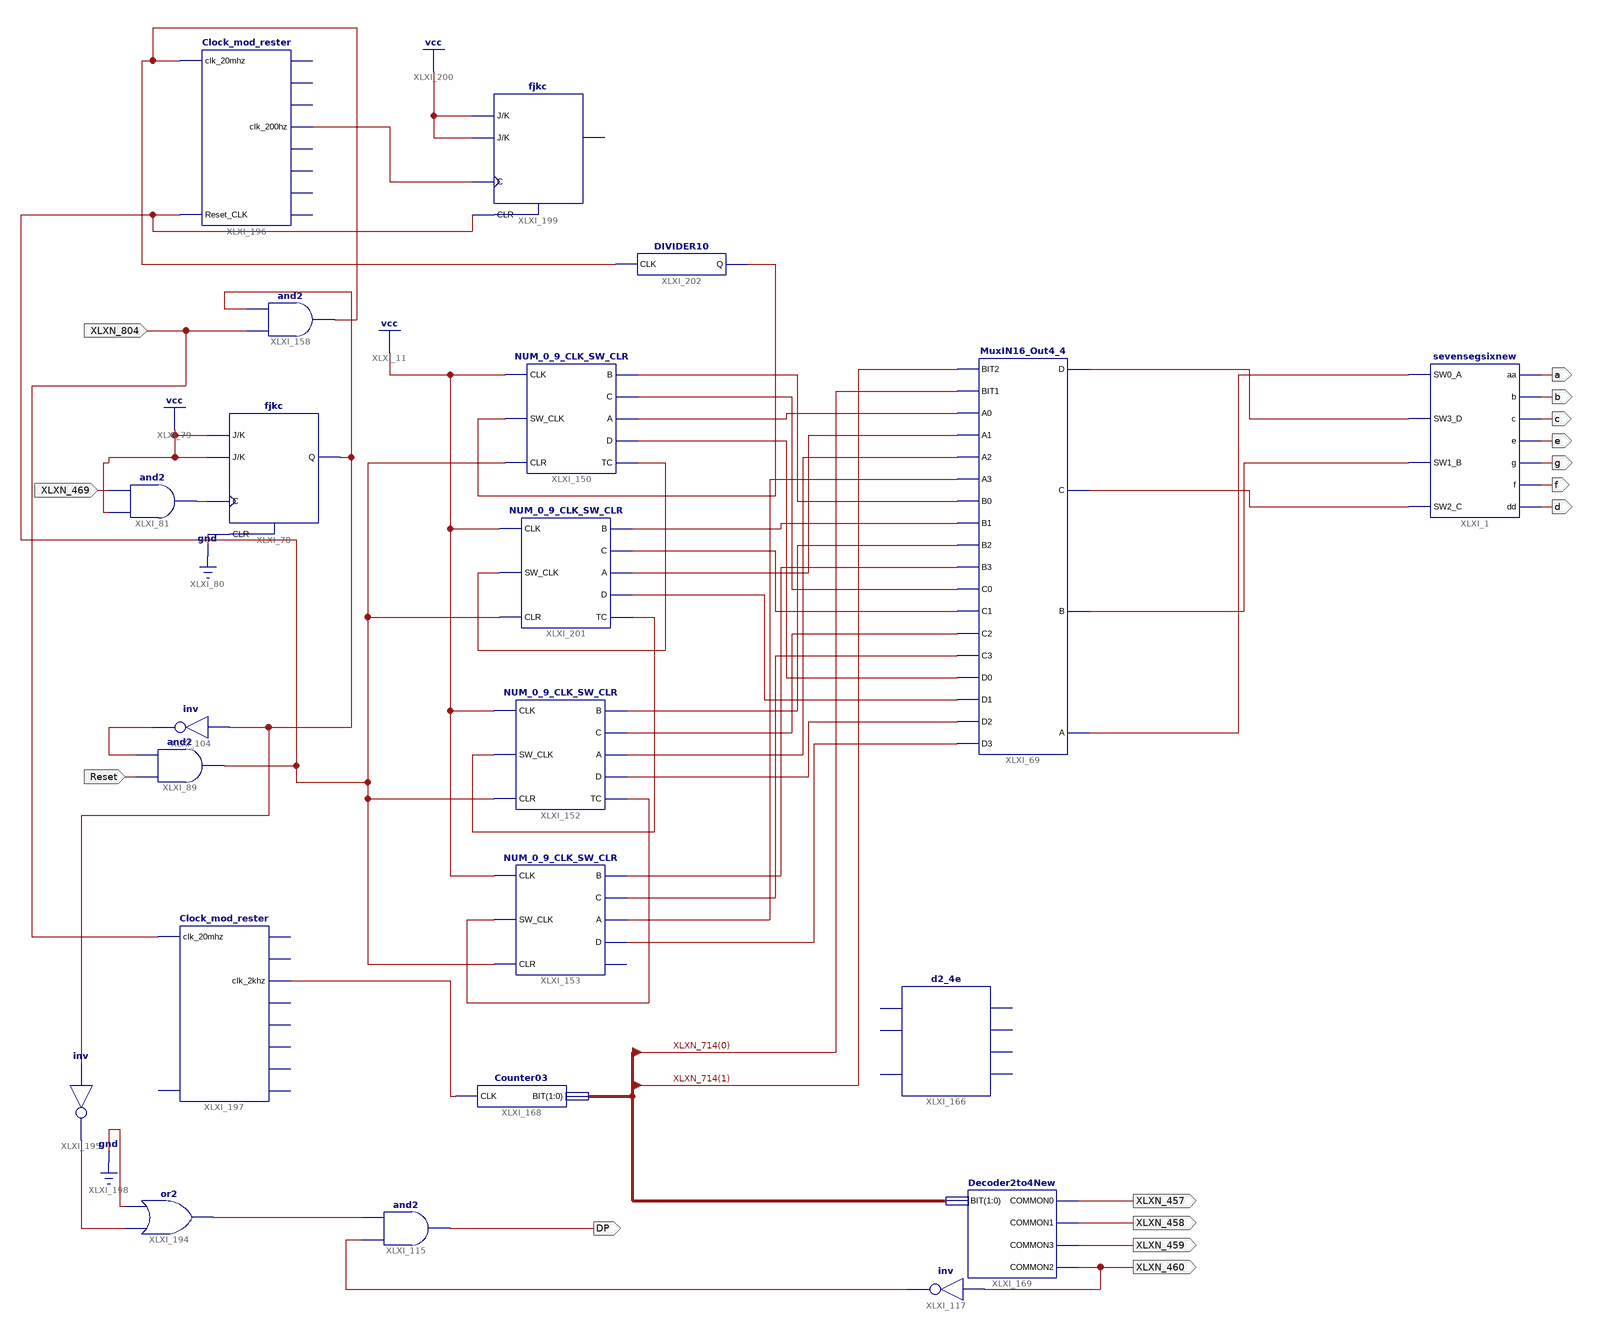
[diagram p0: schematic sheet 1]
// Xilinx ISE schematic SecondTest.sch (spartan6) as structural Verilog: 22 symbols, 15 ports
module SecondTest (
  input  XLXN_469,
  input  Reset,
  input  XLXN_804,
  output a,
  output b,
  output c,
  output e,
  output g,
  output f,
  output d,
  output XLXN_457,
  output XLXN_458,
  output XLXN_460,
  output DP,
  output XLXN_459
);

  wire XLXN_422, XLXN_423, XLXN_424, XLXN_425, XLXN_464, XLXN_468, XLXN_576, XLXN_639, XLXN_640, XLXN_641,
       XLXN_642, XLXN_653, XLXN_661, XLXN_662, XLXN_664, XLXN_665, XLXN_666, XLXN_667, XLXN_668, XLXN_669,
       XLXN_670, XLXN_671, XLXN_706, XLXN_726, XLXN_799, XLXN_802, XLXN_808, XLXN_810, XLXN_817, XLXN_818,
       XLXN_819, XLXN_820, XLXN_821, XLXN_822;
  wire [1:0] XLXN_714;

  sevensegsixnew XLXI_1 (
    .SW0_A(XLXN_425), .SW3_D(XLXN_422), .SW1_B(XLXN_424), .SW2_C(XLXN_423), .aa(a), .b(b), .c(c), .e(e),
    .g(g), .f(f), .dd(d));
  MuxIN16_Out4_4 XLXI_69 (
    .BIT2(XLXN_714[1]), .BIT1(XLXN_714[0]), .A0(XLXN_641), .A1(XLXN_819), .A2(XLXN_666), .A3(XLXN_670),
    .B0(XLXN_639), .B1(XLXN_820), .B2(XLXN_664), .B3(XLXN_668), .C0(XLXN_640), .C1(XLXN_818), .C2(XLXN_665),
    .C3(XLXN_669), .D0(XLXN_642), .D1(XLXN_817), .D2(XLXN_667), .D3(XLXN_671), .D(XLXN_422), .C(XLXN_423),
    .B(XLXN_424), .A(XLXN_425));
  fjkc XLXI_78 (.C(XLXN_468), .CLR(1'b0), .J(1'b1), .K(1'b1), .Q(XLXN_726));
  and XLXI_81 (XLXN_468, 1'b1, XLXN_469);
  and XLXI_89 (XLXN_802, Reset, XLXN_464);
  not XLXI_104 (XLXN_464, XLXN_726);
  not XLXI_117 (XLXN_576, XLXN_460);
  NUM_0_9_CLK_SW_CLR XLXI_152 (
    .CLK(1'b1), .SW_CLK(XLXN_661), .CLR(XLXN_802), .B(XLXN_664), .C(XLXN_665), .A(XLXN_666), .D(XLXN_667),
    .TC(XLXN_662));
  NUM_0_9_CLK_SW_CLR XLXI_153 (
    .CLK(1'b1), .SW_CLK(XLXN_662), .CLR(XLXN_802), .B(XLXN_668), .C(XLXN_669), .A(XLXN_670), .D(XLXN_671));  // open: TC
  d2_4e XLXI_166 ();  // open: A0, A1, E, D0, D1, D2, D3
  Counter03 XLXI_168 (.CLK(XLXN_810), .BIT(XLXN_714));
  Decoder2to4New XLXI_169 (
    .BIT(XLXN_714), .COMMON0(XLXN_457), .COMMON1(XLXN_458), .COMMON3(XLXN_459), .COMMON2(XLXN_460));
  and XLXI_115 (DP, XLXN_576, XLXN_706);
  or XLXI_194 (XLXN_706, XLXN_799, 1'b0);
  not XLXI_195 (XLXN_799, XLXN_726);
  and XLXI_158 (XLXN_808, XLXN_804, XLXN_726);
  Clock_mod_rester XLXI_196 (
    .clk_20mhz(XLXN_808), .Reset_CLK(XLXN_802), .clk_200hz(XLXN_821));  // open: clk_2mhz, clk_200khz, clk_2khz, clk_2hz, clk_20khz, clk_20hz, clk_1hz
  Clock_mod_rester XLXI_197 (
    .clk_20mhz(XLXN_804), .clk_2khz(XLXN_810));  // open: Reset_CLK, clk_2mhz, clk_200khz, clk_200hz, clk_2hz, clk_20khz, clk_20hz, clk_1hz
  fjkc XLXI_199 (.C(XLXN_821), .CLR(XLXN_802), .J(1'b1), .K(1'b1));  // open: Q
  NUM_0_9_CLK_SW_CLR XLXI_201 (
    .CLK(1'b1), .SW_CLK(XLXN_653), .CLR(XLXN_802), .B(XLXN_820), .C(XLXN_818), .A(XLXN_819), .D(XLXN_817),
    .TC(XLXN_661));
  NUM_0_9_CLK_SW_CLR XLXI_150 (
    .CLK(1'b1), .SW_CLK(XLXN_822), .CLR(XLXN_802), .B(XLXN_639), .C(XLXN_640), .A(XLXN_641), .D(XLXN_642),
    .TC(XLXN_653));
  DIVIDER10 XLXI_202 (.CLK(XLXN_808), .Q(XLXN_822));
endmodule
